# EAGLE schematic Light_Sensor (EAGLE 6.4)
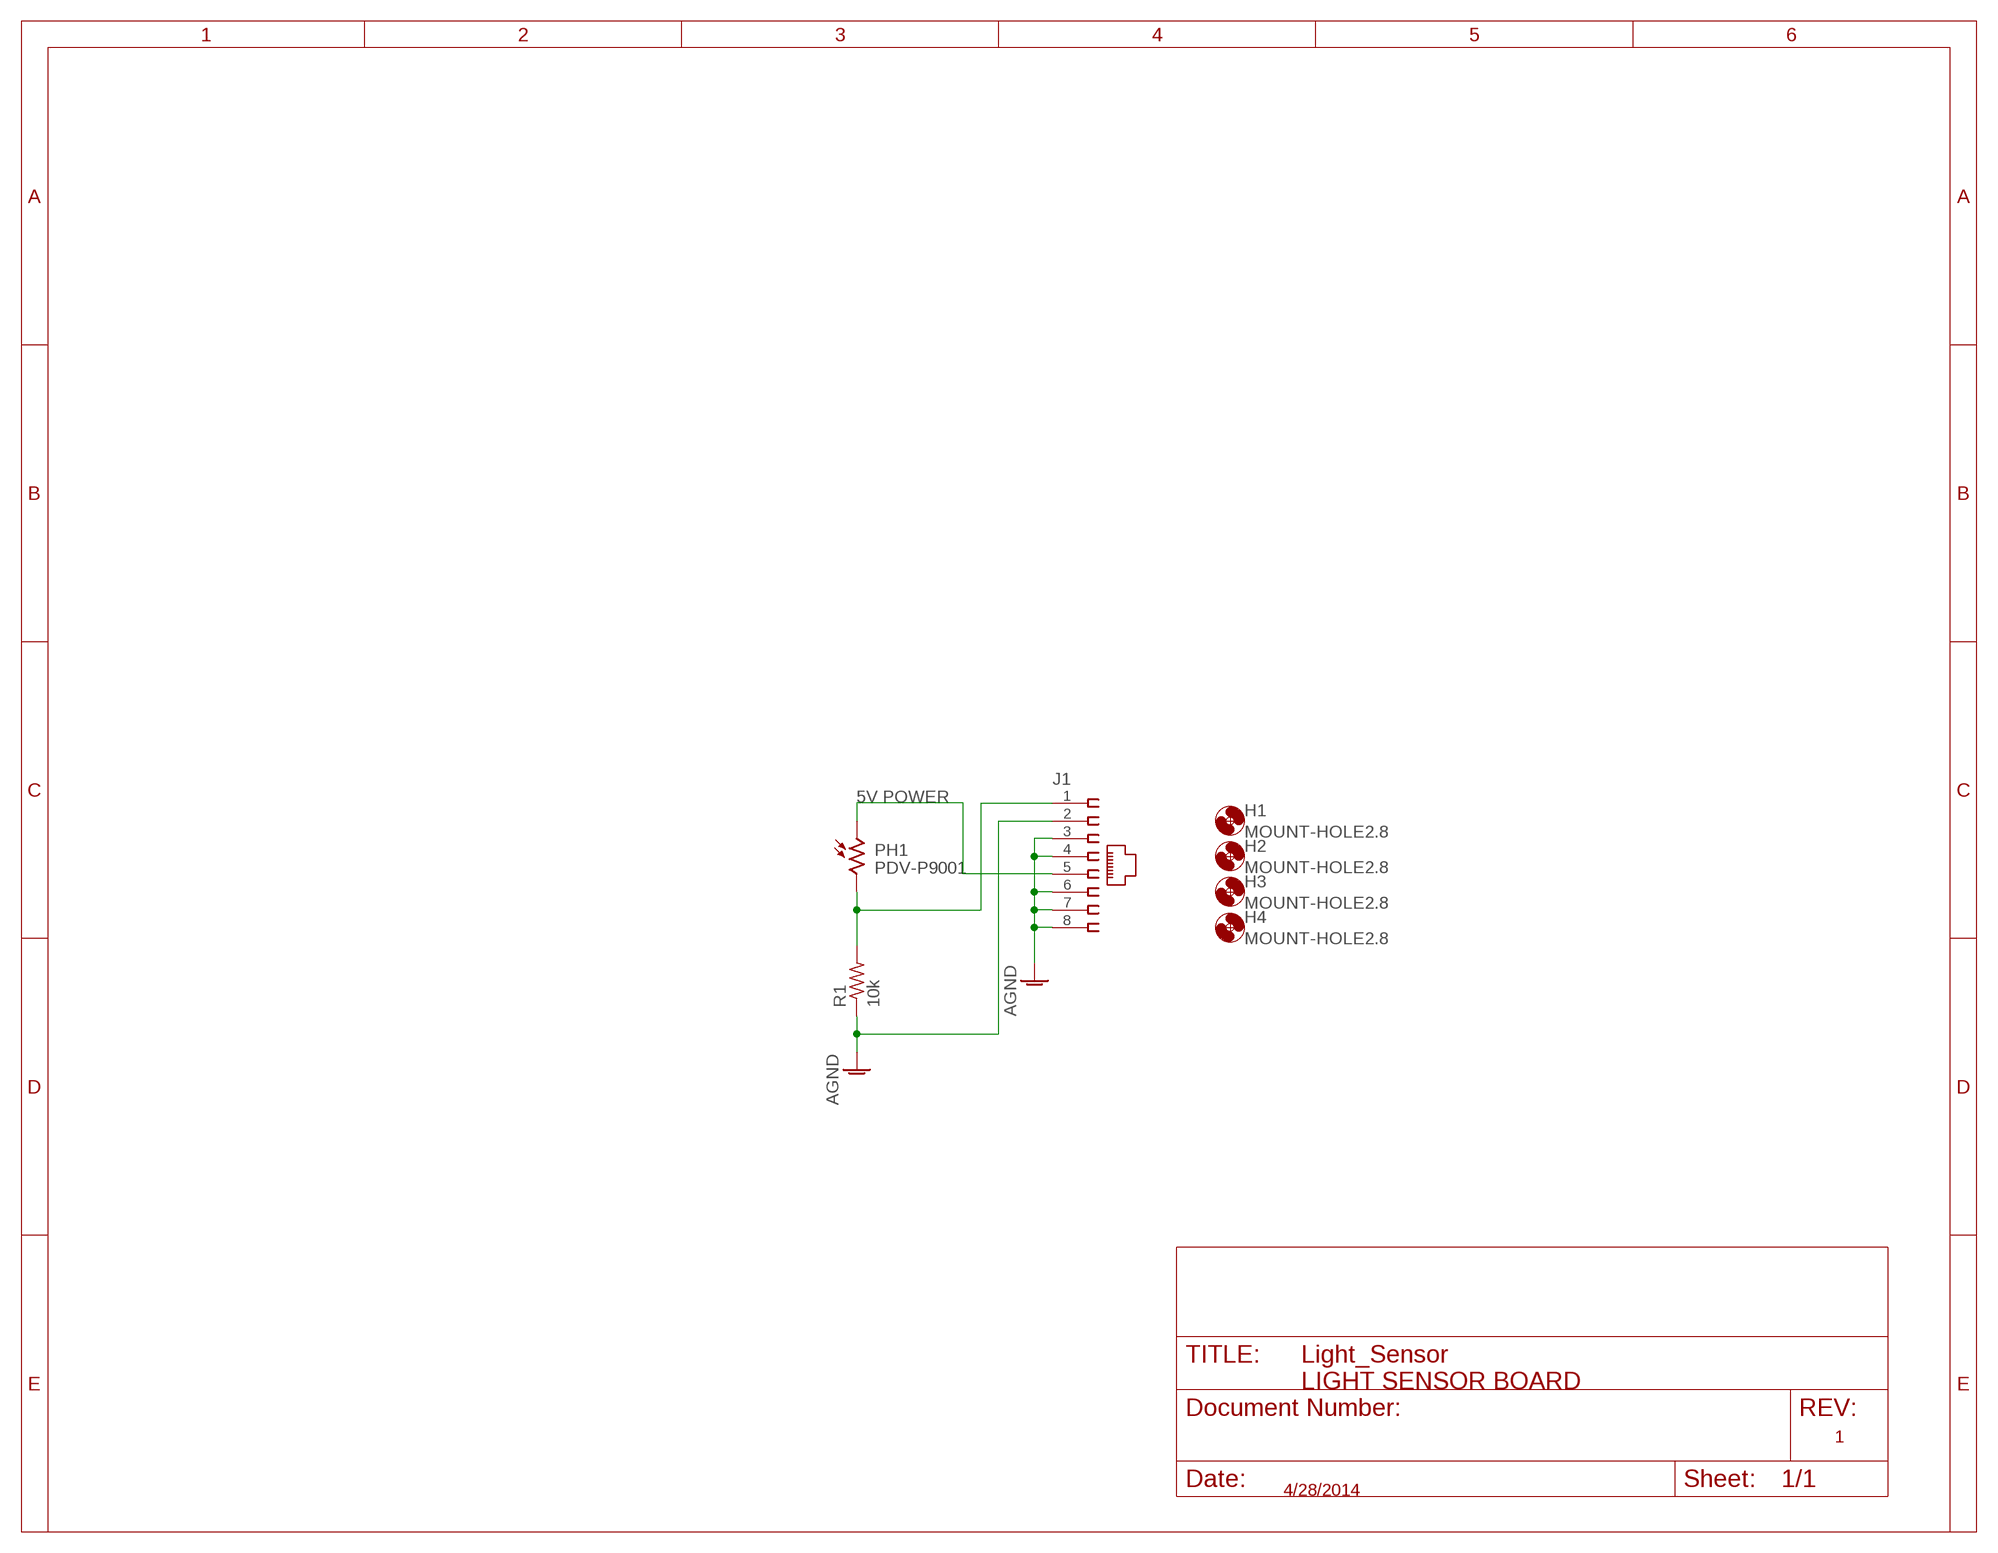
[diagram p0: schematic, sheet 1]

## Parts
H1  MOUNT-HOLE2.8  [2,8]
H2  MOUNT-HOLE2.8  [2,8]
H3  MOUNT-HOLE2.8  [2,8]
H4  MOUNT-HOLE2.8  [2,8]
J1  555167-1  [555167-1]
PH1  VT83N2  [VT800]
R1  10k  R-US_R1206  [R1206]

## Nets
AGND: J1.2 J1.3 J1.4 J1.6 J1.7 J1.8 R1.1
N$1: J1.5 PH1.1
N$2: J1.1 PH1.2 R1.2

## Notes on the sheet
- 5V POWER
- PDV-P9001
- LIGHT SENSOR BOARD
- 1
- 4/28/2014

## Library data of the parts
H1-H4 = holes:MOUNT-HOLE: MOUNTING HOLE with drill center marker
J1 = con-amp:555167-1: AMP connector
PH1 = photo-elements:VT8: Photoconductive Cell VT800 Series Source: http://optoelectronics.perkinelmer.com/content/Datasheets/DTS_vt800seriesdatasheet.pdf
R1 = rcl:R-US_: RESISTOR, American symbol